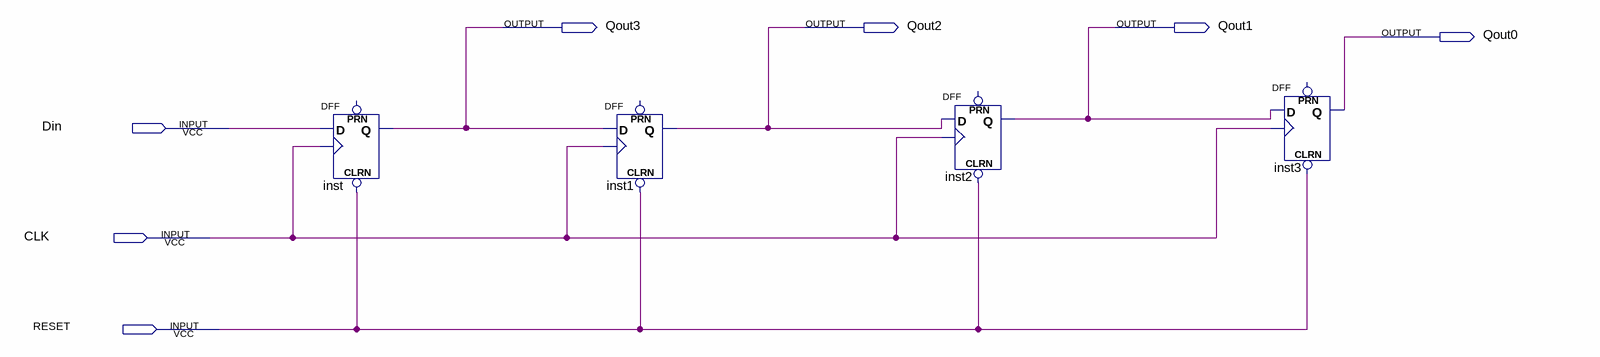
[diagram p0: schematic sheet]
// Quartus schematic hw3_3.bdf as structural Verilog: 4 symbols, 7 pins
module hw3_3 (
  input  Din,
  input  CLK,
  input  RESET,
  output Qout3,
  output Qout2,
  output Qout1,
  output Qout0
);

  DFF inst (.CLRN(RESET), .CLK(CLK), .D(Din), .Q(Qout3));  // open: PRN
  DFF inst1 (.CLRN(RESET), .CLK(CLK), .D(Qout3), .Q(Qout2));  // open: PRN
  DFF inst2 (.CLRN(RESET), .CLK(CLK), .D(Qout2), .Q(Qout1));  // open: PRN
  DFF inst3 (.CLRN(RESET), .CLK(CLK), .D(Qout1), .Q(Qout0));  // open: PRN
endmodule
